# EAGLE design lm3410-sepic-led-driver-20mm-mk1 (EAGLE 6.4)
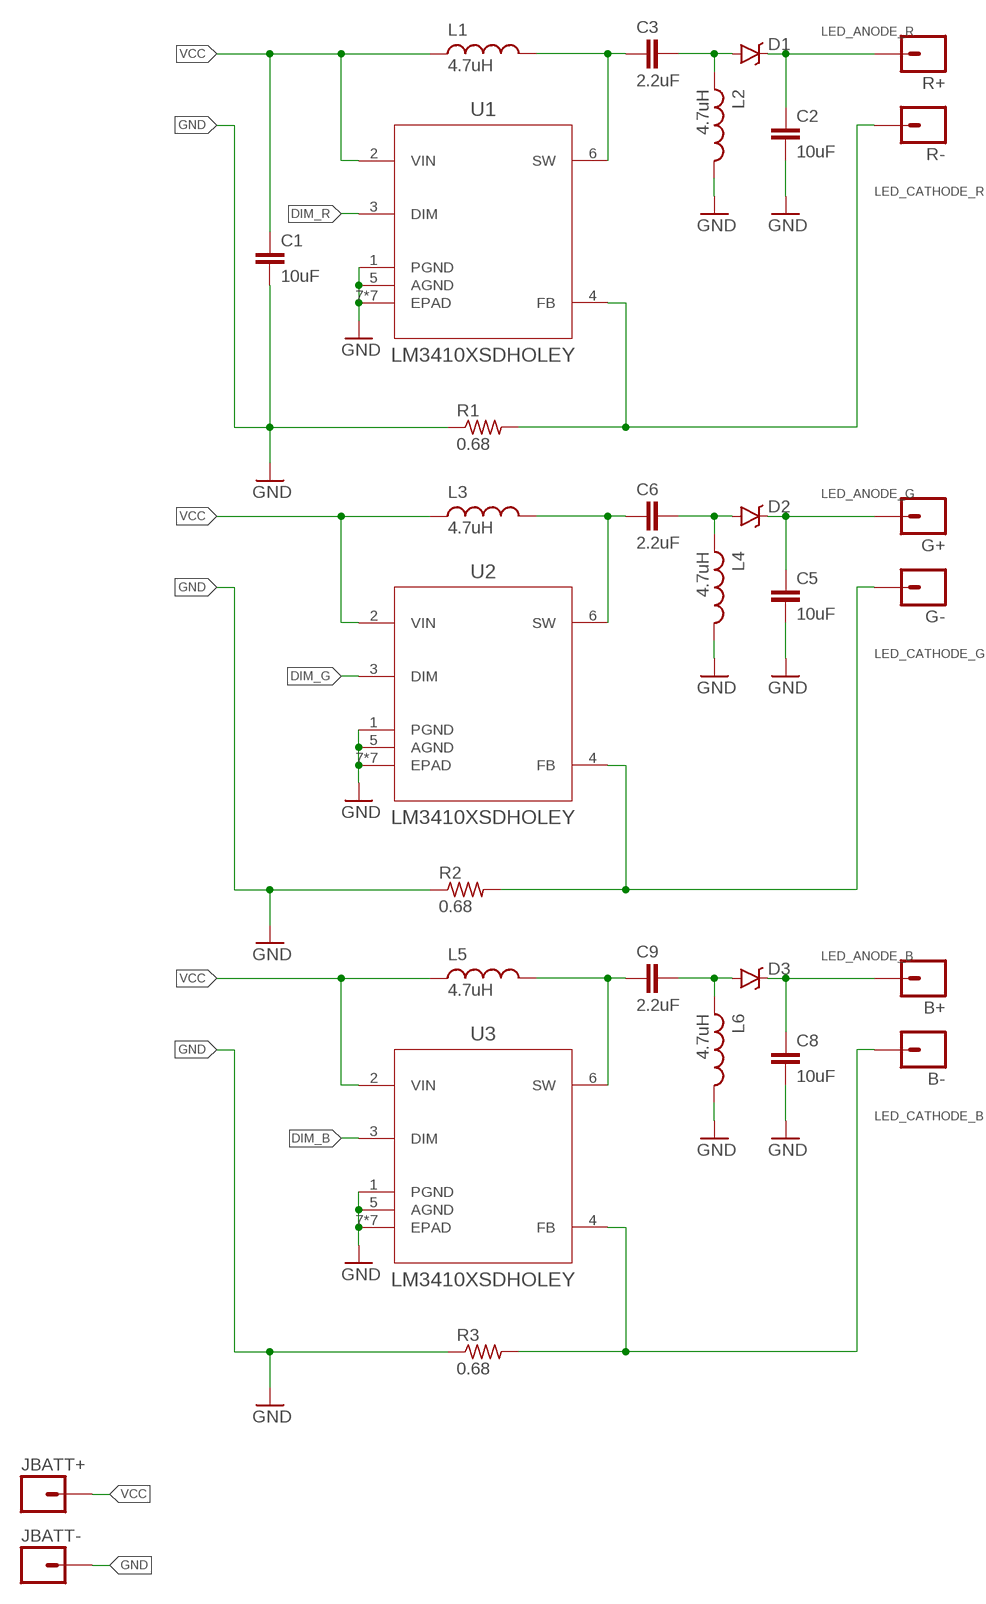
[diagram p0: schematic, sheet 1]

## Parts
B+  M01PTH-1.2MM  [1X01-1.2MM]
B-  M01PTH-1.2MM-NS  [1X01-1.2MM-NS]
C1  10uF  CAPACITOR-CERAMICC0603  [C0603]
C2  10uF  CAPACITOR-CERAMICC0603  [C0603]
C3  2.2uF  CAPACITOR-CERAMICC0805  [C0805]
C5  10uF  CAPACITOR-CERAMICC0603  [C0603]
C6  2.2uF  CAPACITOR-CERAMICC0805  [C0805]
C8  10uF  CAPACITOR-CERAMICC0603  [C0603]
C9  2.2uF  CAPACITOR-CERAMICC0805  [C0805]
D1  PMEG4005EJ  DIODE-SCHOTTKY-PMEG4005EJ  [SOD-323]
D2  PMEG4005EJ  DIODE-SCHOTTKY-PMEG4005EJ  [SOD-323]
D3  PMEG4005EJ  DIODE-SCHOTTKY-PMEG4005EJ  [SOD-323]
G+  M01PTH-1.2MM  [1X01-1.2MM]
G-  M01PTH-1.2MM-NS  [1X01-1.2MM-NS]
JBATT+  M01NOT-A-VIA-NOPE  [1X01_NOSILK_NOSTOP]
JBATT-  M01NOT-A-VIA-NOPE  [1X01_NOSILK_NOSTOP]
L1  4.7uH  INDUCTORIFSC-0806  [INDUCTOR_2X1.6MM]
L2  4.7uH  INDUCTORIFSC-0806  [INDUCTOR_2X1.6MM]
L3  4.7uH  INDUCTORIFSC-0806  [INDUCTOR_2X1.6MM]
L4  4.7uH  INDUCTORIFSC-0806  [INDUCTOR_2X1.6MM]
L5  4.7uH  INDUCTORIFSC-0806  [INDUCTOR_2X1.6MM]
L6  4.7uH  INDUCTORIFSC-0806  [INDUCTOR_2X1.6MM]
R1  0.68  RESISTORR1206  [R1206]
R2  0.68  RESISTORR1206  [R1206]
R3  0.68  RESISTORR1206  [R1206]
R+  M01PTH-1.2MM  [1X01-1.2MM]
R-  M01PTH-1.2MM-NS  [1X01-1.2MM-NS]
U1  LM3410XSDHOLEY  [DFN300X300X80-7N-HOLES]
U2  LM3410XSDHOLEY  [DFN300X300X80-7N-HOLES]
U3  LM3410XSDHOLEY  [DFN300X300X80-7N-HOLES]

## Nets
DIM_B: U3.3(DIM)
DIM_G: U2.3(DIM)
DIM_R: U1.3(DIM)
GND: C1.2 C2.2 C5.2 C8.2 JBATT-.P$1 L2.P$2 L4.P$2 L6.P$2 R1.1 R2.1 R3.1 U1.1(PGND) U1.5(AGND) U1.7(EPAD) U1.7@1(EPAD) U1.7@2(EPAD) U1.7@3(EPAD) U1.7@4(EPAD) U1.7@5(EPAD) U1.7@6(EPAD) U2.1(PGND) U2.5(AGND) U2.7(EPAD) U2.7@1(EPAD) U2.7@2(EPAD) U2.7@3(EPAD) U2.7@4(EPAD) U2.7@5(EPAD) U2.7@6(EPAD) U3.1(PGND) U3.5(AGND) U3.7(EPAD) U3.7@1(EPAD) U3.7@2(EPAD) U3.7@3(EPAD) U3.7@4(EPAD) U3.7@5(EPAD) U3.7@6(EPAD)
LED_ANODE_B: B+.P$1 C8.1 D3.C
LED_ANODE_G: C5.1 D2.C G+.P$1
LED_ANODE_R: C2.1 D1.C R+.P$1
LED_CATHODE_B: B-.P$1 R3.2 U3.4(FB)
LED_CATHODE_G: G-.P$1 R2.2 U2.4(FB)
LED_CATHODE_R: R1.2 R-.P$1 U1.4(FB)
N$1: C3.2 D1.A L2.P$1
N$2: C6.2 D2.A L4.P$1
N$5: C9.2 D3.A L6.P$1
SW: C3.1 L1.P$2 U1.6(SW)
SW1: C6.1 L3.P$2 U2.6(SW)
SW2: C9.1 L5.P$2 U3.6(SW)
VCC: C1.1 JBATT+.P$1 L1.P$1 L3.P$1 L5.P$1 U1.2(VIN) U2.2(VIN) U3.2(VIN)

## Library data of the parts
B+ B- G+ G- JBATT+ JBATT- R+ R- = A_butts:M01: Header 1 Standard 1-pin 0.1" header. Use with straight break away headers (SKU : PRT-00116), right angle break away headers (PRT-00553), swiss pins (PRT-00743), machine pins (PRT-00117), and female headers (PRT-00115).
C1-C3 C5 C6 C8 C9 = A_butts:CAPACITOR-CERAMIC: CAPACITOR, European symbol
D1-D3 = A_butts:DIODE-SCHOTTKY: Schottky diodes in SFE's production catalog BAT20J 1A 23V 0.62Vf RB751 120mA 40V 0.37Vf PMEG4005EJ 0.5A 40V 0.42Vf MBRA140 1A 40V 0.5Vf B340A 3A 40V SMA; PROD_ID: DIO-10955
L1-L6 = A_butts:INDUCTOR: Inductors Basic Inductor/Choke - 0603 and 1206. Footprints are not proven and vary greatly between part numbers. SRN6045- 33uH, 20% 1.4A SDR0403-560KL - 56uH, 10%, 500mA RMS/740mA peak
R1-R3 = A_butts:RESISTOR: RESISTOR, American symbol
U1-U3 = A_butts:LM3410XSD: Constant Current Boost and SEPIC LED Driver

## Board
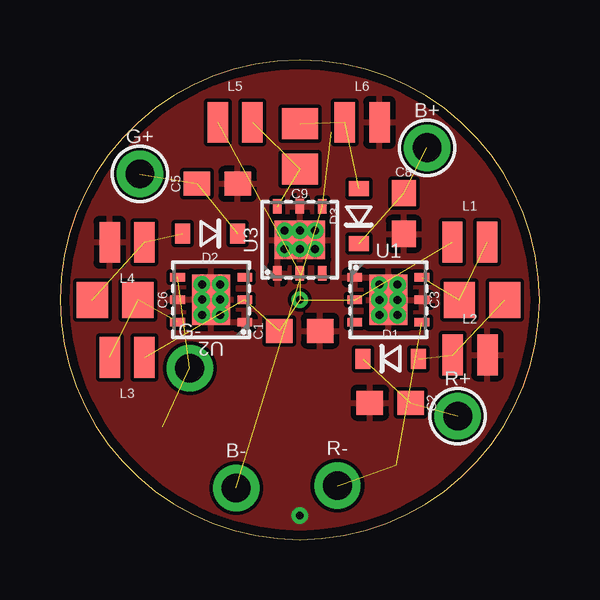
[diagram p1: board, top side]
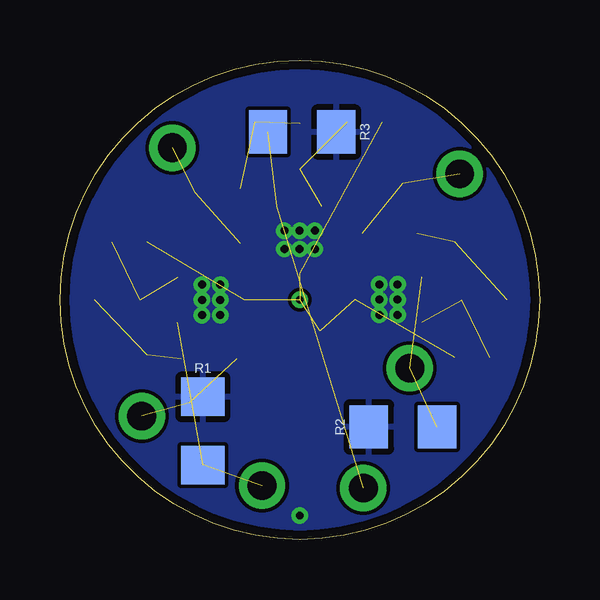
[diagram p2: board, bottom side, seen from below]

Size 20 x 20 mm. Coordinates in mm from the lower left corner, seen from the top.
Outline: 0,10 arc90 10,0 arc90 20,10 arc90 10,20 arc90 0,10
Copper layers (1*16): Top 0.0356mm / dielectric 1.5011mm / Bottom 0.0356mm
Design rules "LaenPCBOrder2": minimum track width 6mil, minimum drill 13mil, track to track 6mil, track to pad 6mil, pad to pad 6mil, via to via 6mil, smd to smd 6mil, copper to edge 15mil, drill to drill 6mil, minimum pad ring 7mil, minimum via ring 7mil, stop-mask expansion 3mil, vias tented up to drill 20mil, thermal gap 10mil

### Footprints (pad centres in the part's own frame; a part is rotated, then mirrored left to right if it is on the bottom)
1X01-1.2MM = drill 1.2 pad 1.93: P$1 0,0
1X01-1.2MM-NS = drill 1.2 pad 1.93: P$1 0,0
C0603 = smd 1.1 x 1: 1 -0.85,0; 2 0.85,0
C0805 = smd 1.3 x 1.5: 1 -0.95,0; 2 0.95,0
SOD-323 = smd 0.63 x 0.83: A 1.15,0; C -1.15,0
1X01_NOSILK_NOSTOP = drill 0.33: P$1 0,0
INDUCTOR_2X1.6MM = smd 0.85 x 1.7: P$1 -0.725,0; P$2 0.725,0
R1206 = smd 1.6 x 1.803: 1 -1.422,0; 2 1.422,0
DFN300X300X80-7N-HOLES = smd 0.61 x 0.356: 1 -1.401,0.936; 2 -1.401,-0.004; 3 -1.401,-0.944; 4 1.393,-0.944; 5 1.393,-0.004; 6 1.393,0.936 | smd 1.6 x 2.108: 7 -0.004,-0.004 | drill 0.33: 7@1 -0.385,0.631; 7@2 0.377,0.631; 7@3 0.377,-0.639; 7@4 -0.385,-0.639; 7@5 -0.385,-0.004; 7@6 0.377,-0.004

### Placement (x,y rotation side)
B+  15.31,16.34 0 top
B-  7.35,2.15 0 top
C1  10,8.7 0 top
C2  13.77,5.7 180 top
C3  17.6,10 0 top
C5  6.56,14.84 0 top
C6  2.3,10 180 top
C8  14.34,13.6 270 top
C9  10,16.4 90 top
D1  13.79,7.54 0 top
D2  6.26,12.76 180 top
D3  12.46,13.49 90 top
G+  3.33,15.25 0 top
G-  5.41,7.15 0 top
JBATT+  10,10 0 top
JBATT-  10,1 0 top
L1  17.09,12.41 0 top
L2  17.1,7.7 0 top
L3  2.8,7.6 180 top
L4  2.8,12.4 180 top
L5  7.3,17.4 0 top
L6  12.6,17.4 0 top
R1  14.04,4.53 270 bottom
R2  5.7,4.7 0 bottom
R3  9.9,17 180 bottom
R+  16.59,5.15 0 top
R-  11.57,2.25 0 top
U1  13.7,10 0 top
U2  6.3,10 180 top
U3  10,12.5 90 top

### Tracks (layer width: path | path; a pad name or v marks a point on that pad's centre or on a via)
GND
  pour Top: 10,0 arc-90 0,10 arc-90 10,20 arc-90 20,10 arc-90
  pour Bottom (rank 6): 10,0 arc-90 0,10 arc-90 10,20 arc-90 20,10 arc-90
LED_ANODE_B  (2 unrouted)
LED_ANODE_G  (2 unrouted)
LED_ANODE_R  (2 unrouted)
LED_CATHODE_B  (2 unrouted)
LED_CATHODE_G  (2 unrouted)
LED_CATHODE_R  (2 unrouted)
N$1  (2 unrouted)
N$2  (2 unrouted)
N$5  (2 unrouted)
SW  (2 unrouted)
SW1  (2 unrouted)
SW2  (2 unrouted)
VCC  (7 unrouted)